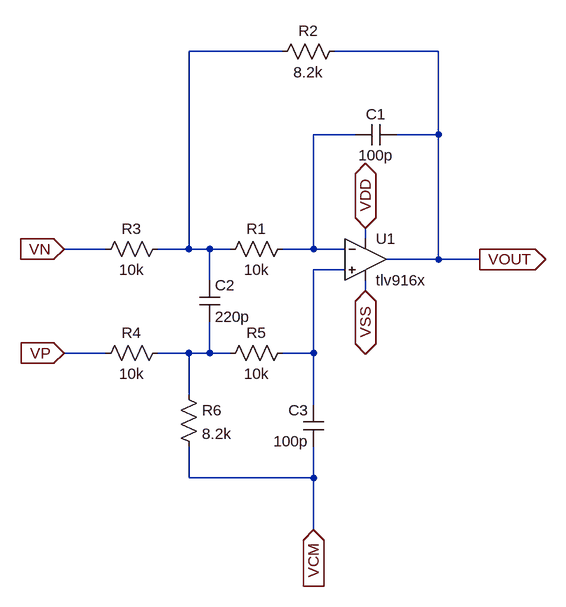
[diagram p0: schematic dac_filter.asc]
dac_filter.asc, the LTspice schematic file:
Version 4.1
SHEET 1 880 680
WIRE 32 -192 -112 -192
WIRE 272 -192 112 -192
WIRE 144 -64 80 -64
WIRE 272 -64 272 -192
WIRE 272 -64 208 -64
WIRE 160 96 160 80
WIRE -240 112 -304 112
WIRE -112 112 -112 -192
WIRE -112 112 -160 112
WIRE -80 112 -112 112
WIRE -48 112 -80 112
WIRE 80 112 80 -64
WIRE 80 112 32 112
WIRE 128 112 80 112
WIRE 272 128 272 -64
WIRE 272 128 192 128
WIRE 336 128 272 128
WIRE 128 144 80 144
WIRE -80 160 -80 112
WIRE 160 176 160 160
WIRE -240 272 -304 272
WIRE -112 272 -160 272
WIRE -80 272 -80 224
WIRE -80 272 -112 272
WIRE -48 272 -80 272
WIRE 80 272 80 144
WIRE 80 272 32 272
WIRE -112 336 -112 272
WIRE 80 352 80 272
WIRE -112 464 -112 416
WIRE 80 464 80 416
WIRE 80 464 -112 464
WIRE 80 544 80 464
FLAG 80 544 VCM
IOPIN 80 544 In
FLAG -304 272 VP
IOPIN -304 272 In
FLAG -304 112 VN
IOPIN -304 112 In
FLAG 336 128 VOUT
IOPIN 336 128 Out
FLAG 160 176 VSS
IOPIN 160 176 BiDir
FLAG 160 80 VDD
IOPIN 160 80 BiDir
SYMBOL OpAmps\\opamp2 160 64 R0
SYMATTR InstName U1
SYMATTR Value tlv916x
SYMBOL res 48 96 R90
WINDOW 0 0 56 VBottom 2
WINDOW 3 32 56 VTop 2
SYMATTR InstName R1
SYMATTR Value 10k
SYMBOL cap 208 -80 R90
WINDOW 0 0 32 VBottom 2
WINDOW 3 32 32 VTop 2
SYMATTR InstName C1
SYMATTR Value 100p
SYMBOL res 128 -208 R90
WINDOW 0 0 56 VBottom 2
WINDOW 3 32 56 VTop 2
SYMATTR InstName R2
SYMATTR Value 8.2k
SYMBOL cap -96 160 R0
SYMATTR InstName C2
SYMATTR Value 220p
SYMBOL res -144 96 R90
WINDOW 0 0 56 VBottom 2
WINDOW 3 32 56 VTop 2
SYMATTR InstName R3
SYMATTR Value 10k
SYMBOL res -144 256 R90
WINDOW 0 0 56 VBottom 2
WINDOW 3 32 56 VTop 2
SYMATTR InstName R4
SYMATTR Value 10k
SYMBOL res 48 256 R90
WINDOW 0 0 56 VBottom 2
WINDOW 3 32 56 VTop 2
SYMATTR InstName R5
SYMATTR Value 10k
SYMBOL cap 96 416 R180
WINDOW 0 24 56 Left 2
WINDOW 3 24 8 Left 2
SYMATTR InstName C3
SYMATTR Value 100p
SYMBOL res -128 320 R0
SYMATTR InstName R6
SYMATTR Value 8.2k

The netlist it stands for:
* dac_filter.asc
X§U1 N003 N002 VDD VSS VOUT tlv916x  ; pins In+ In- V+ V- OUT
R1 N002 N001 10k
C1 VOUT N002 100p
R2 VOUT N001 8.2k
C2 N001 N004 220p
R3 N001 VN 10k
R4 N004 VP 10k
R5 N003 N004 10k
C3 VCM N003 100p
R6 N004 VCM 8.2k
.backanno
.end